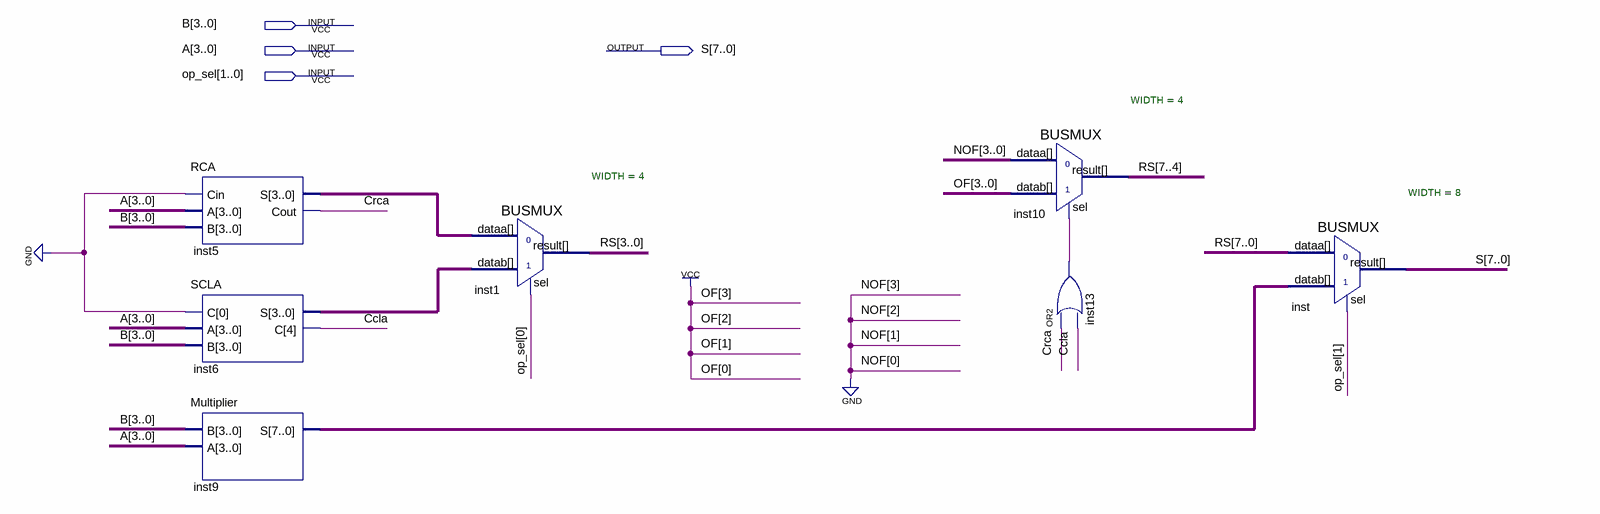
[diagram p0: schematic sheet]
// Quartus schematic ArithmeticUnit.bdf as structural Verilog: 7 symbols, 4 pins
module ArithmeticUnit (
  input  [3:0] B,
  input  [3:0] A,
  input  [1:0] op_sel,
  output [7:0] S
);

  wire Ccla, Crca, inst13_out;
  wire [3:0] inst5_s, inst6_s;
  wire [7:0] inst9_s, RS;

  RCA inst5 (.A(A), .B(B), .Cin(1'b0), .Cout(Crca), .S(inst5_s));
  SCLA inst6 (.A(A), .B(B), .C({Ccla, 1'b0}), .S(inst6_s));
  Multiplier inst9 (.B(B), .A(A), .S(inst9_s));
  BUSMUX #(.WIDTH(4)) inst1 (.datab(inst6_s), .sel(op_sel[0]), .dataa(inst5_s), .result(RS[3:0]));
  BUSMUX #(.WIDTH(4)) inst10 (.datab(4'b1111), .sel(inst13_out), .dataa(4'b0000), .result(RS[7:4]));
  or inst13 (inst13_out, Crca, Ccla);
  BUSMUX #(.WIDTH(8)) inst (.datab(inst9_s), .sel(op_sel[1]), .dataa(RS), .result(S));
endmodule
